# EAGLE design LED (EAGLE 9.2.2)
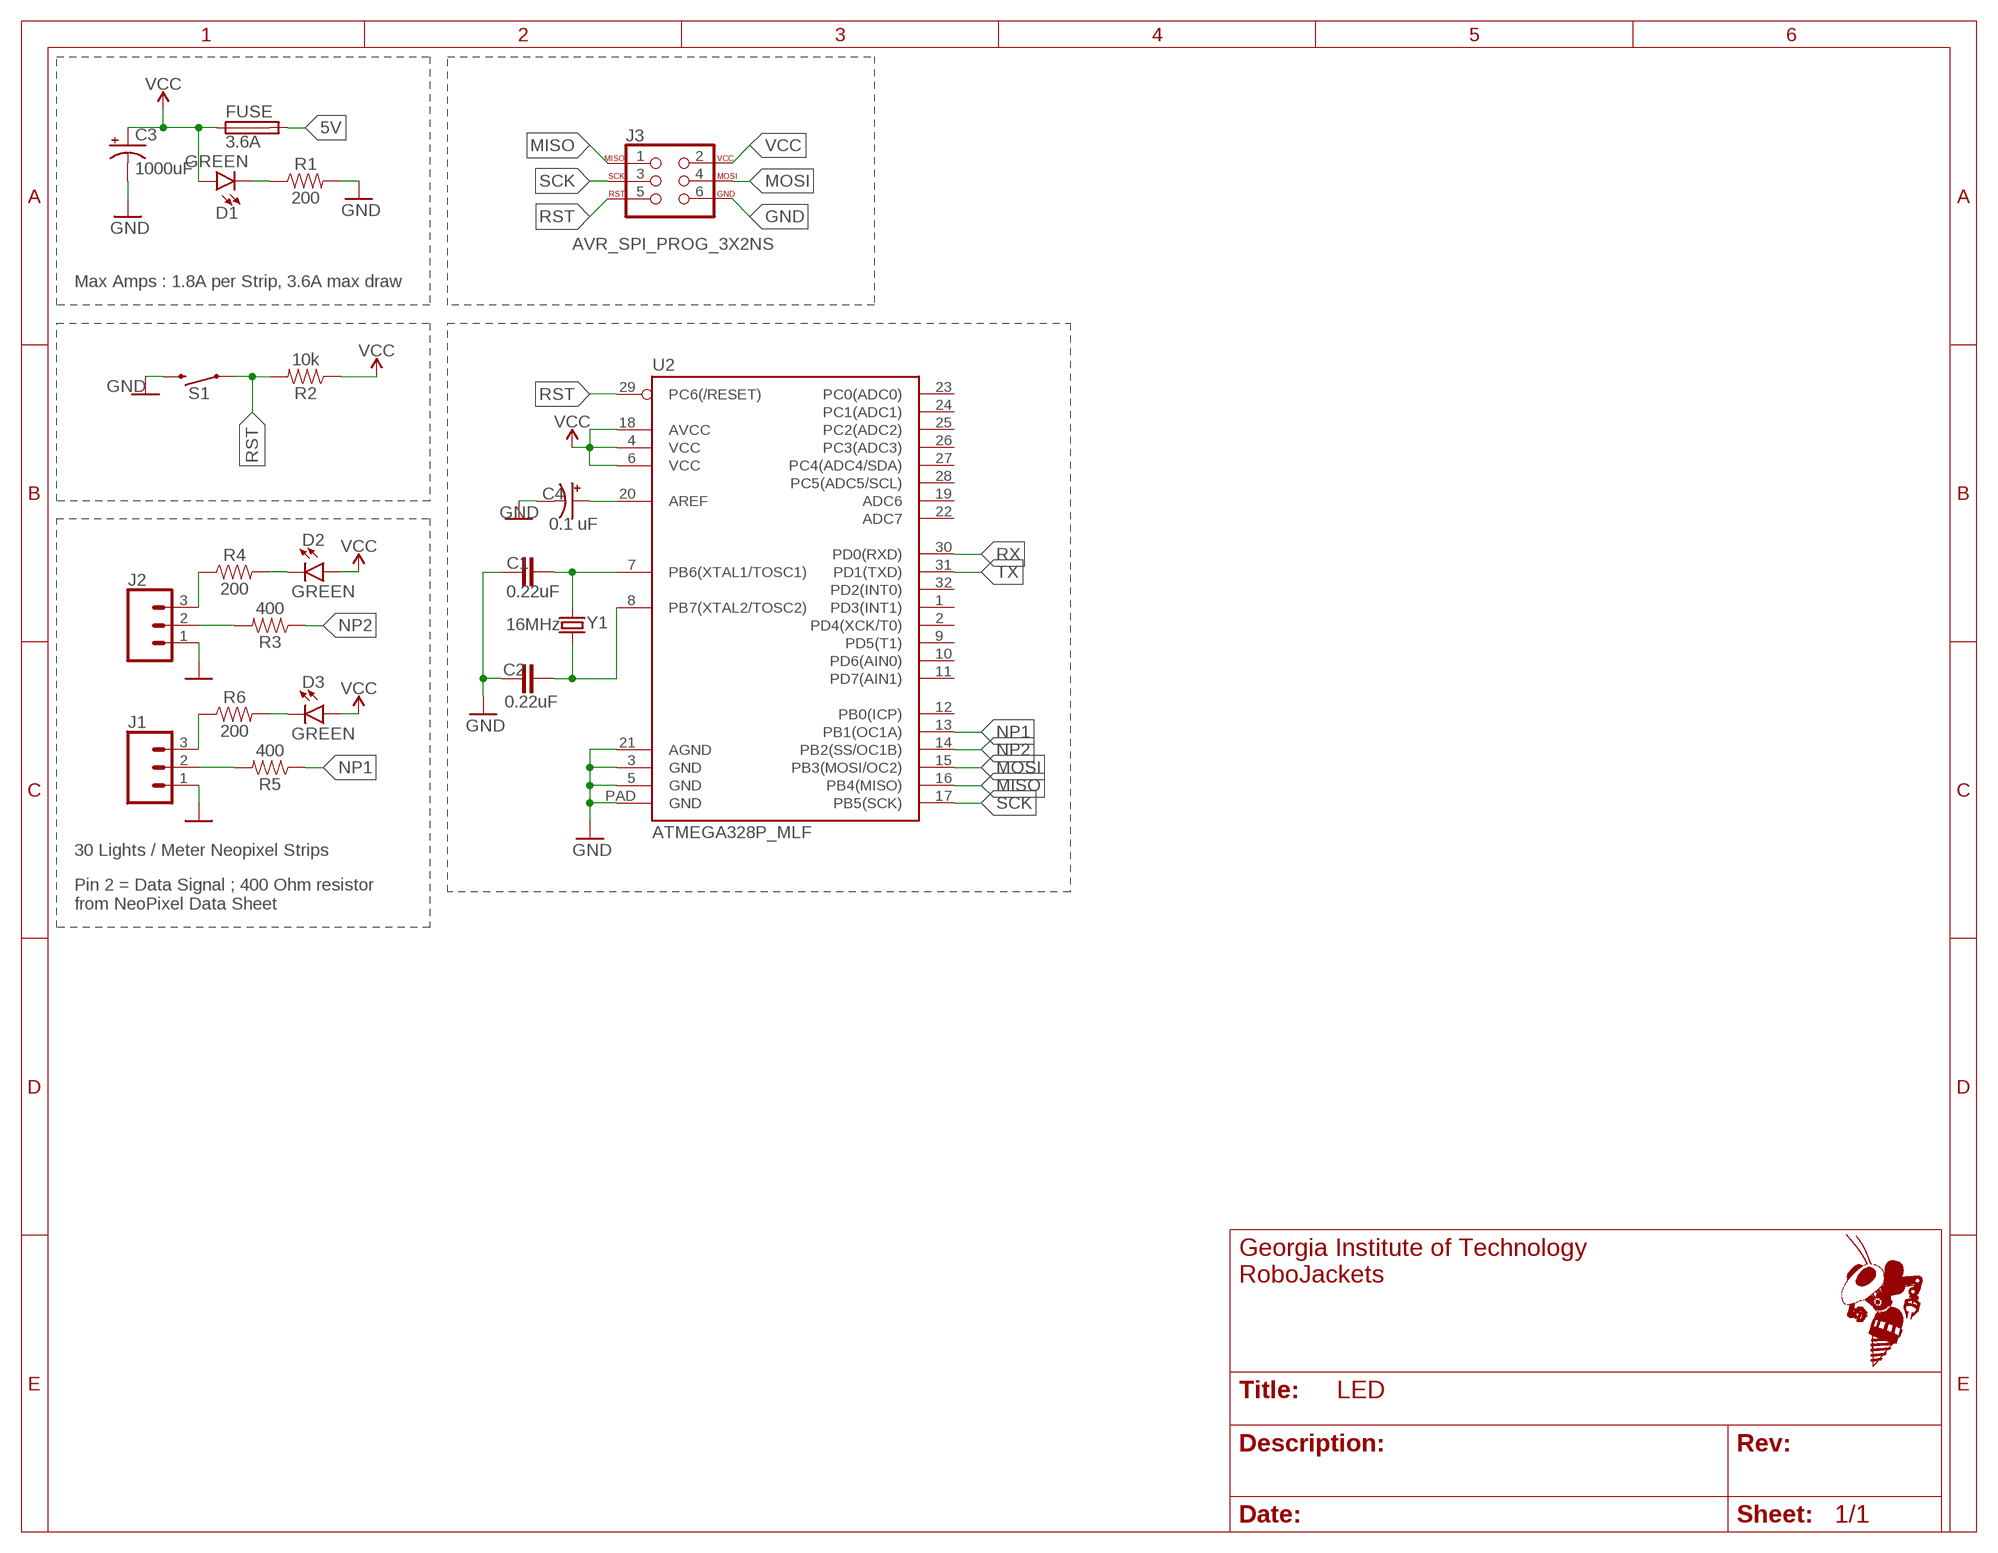
[diagram p0: schematic, sheet 1]

## Parts
C1  0.22uF  0.22UF-0603-25V-10%  [0603]
C2  0.22uF  0.22UF-0603-25V-10%  [0603]
C3  1000uF  1000UF-RADIAL-5MM-25V-20%  [CPOL-RADIAL-5MM-10MM]
C4  0.1 uF  1000UF-RADIAL-5MM-25V-20%  [CPOL-RADIAL-5MM-10MM]
D1  GREEN  LED-GREEN0603  [LED-0603]
D2  GREEN  LED-GREEN0603  [LED-0603]
D3  GREEN  LED-GREEN0603  [LED-0603]
FUSE  3.6A  FUSE_HOLDER  [FUSE_HOLDER]
J1  CONN_03  [1X03]
J2  CONN_03  [1X03]
J3  AVR_SPI_PROG_3X2NS  [2X3-NS]
R1  200  470OHM-0603-1/10W-1%  [0603]
R2  10k  470OHM-0603-1/10W-1%  [0603]
R3  400  470OHM-0603-1/10W-1%  [0603]
R4  200  470OHM-0603-1/10W-1%  [0603]
R5  400  470OHM-0603-1/10W-1%  [0603]
R6  200  470OHM-0603-1/10W-1%  [0603]
S1  MOMENTARY-SWITCH-SPST-PTH-6.0MM-KIT  [TACTILE_SWITCH_PTH_6.0MM_KIT]
U2  ATMEGA328P_MLF  ATMEGA328P_MLFMLF32  [MLF32-PAD]
Y1  16MHz  CRYSTAL-16MHZPTH-HC49US  [HC49US]

## Nets
5V: FUSE.P$3 FUSE.P$4
DATA1: J1.2 R5.2
DATA2: J2.2 R3.2
GND: C1.2 C2.2 C3.- C4.- J1.1 J2.1 J3.6 R1.2 S1.3 U2.3(GND) U2.5(GND) U2.21(AGND) U2.PAD(GND)
MISO: J3.1 U2.16(PB4(MISO))
MOSI: J3.4 U2.15(PB3(MOSI/OC2))
N$1: C4.+ U2.20(AREF)
N$2: D2.C R4.2
N$3: J2.3 R4.1
N$4: D3.C R6.2
N$5: J1.3 R6.1
N$10: D1.C R1.1
NP1: R5.1 U2.13(PB1(OC1A))
NP2: R3.1 U2.14(PB2(SS/OC1B))
RST: J3.5 R2.2 S1.1 U2.29(PC6(/RESET))
RX: U2.30(PD0(RXD))
SCK: J3.3 U2.17(PB5(SCK))
TX: U2.31(PD1(TXD))
VCC: C3.+ D1.A D2.A D3.A FUSE.P$1 FUSE.P$2 J3.2 R2.1 U2.4(VCC) U2.6(VCC) U2.18(AVCC)
XTAL1: C1.1 U2.7(PB6(XTAL1/TOSC1)) Y1.1
XTAL2: C2.1 U2.8(PB7(XTAL2/TOSC2)) Y1.2
Unconnected: U2.1(PD3(INT1)) U2.2(PD4(XCK/T0)) U2.9(PD5(T1)) U2.10(PD6(AIN0)) U2.11(PD7(AIN1)) U2.12(PB0(ICP)) U2.19(ADC6) U2.22(ADC7) U2.23(PC0(ADC0)) U2.24(PC1(ADC1)) U2.25(PC2(ADC2)) U2.26(PC3(ADC3)) U2.27(PC4(ADC4/SDA)) U2.28(PC5(ADC5/SCL)) U2.32(PD2(INT0))

## Notes on the sheet
- Max Amps : 1.8A per Strip, 3.6A max draw
- 30 Lights / Meter Neopixel Strips
- Pin 2 = Data Signal ; 400 Ohm resistor 
  from NeoPixel Data Sheet

## Library data of the parts
C1 C2 = SparkFun-Capacitors:0.22UF: 0.22µF ceramic capacitors A capacitor is a passive two-terminal electrical component used to store electrical energy temporarily in an electric field.; PROD_ID: CAP-07822
C3 C4 = SparkFun-Capacitors:1000UF: 1,000µF/1mF ceramic capacitors A capacitor is a passive two-terminal electrical component used to store electrical energy temporarily in an electric field. CAP-08070; PROD_ID: CAP-09538; VALUE: 1mF
D1-D3 = SparkFun-LED:LED-GREEN: Green SMD LED Used in manufacturing of various products at SparkFun Packages: 0603 - SMD 0603 package [Product Link] <http://www.futureelectronics.com/en/technologies/semiconductors/optoelectronics/leds/Pages/9894312-LTST-C190GKT.aspx?CrossPart=HSMG-C190&IM=0> LilyPad 1206 - SMD1206 LilyPad package [Product Link] <http://www.futureelectronics.com/en/Technologies/Product.aspx?ProductID=IN150NGHARVATEKCORPORATION2049943&IM=0> 1206 - SMD1206 package [Product Link] <http://www.futureelectronics.com/en/technologies/semiconductors/optoelectronics/leds/Pages/8315665-LTST-C150KGKT.aspx?IM=0> 1206 Bottom Mount -SMD 1206 Bottom Mount [Product Link] <http://www.digikey.com/product-detail/en/lite-on-inc/LTST-C230KGKT/160-1456-1-ND/386854> SparkFun Products: Pro Mini 328 -5V <https://www.sparkfun.com/products/821> RedBoard <https://www.sparkfun.com/products/12757> MP3 Trigger <https://www.sparkfun.com/products/13720> Makey Makey <https://www.sparkfun.com/products/11076>; PROD_ID: DIO-00821
FUSE = IGVC-Misc:FUSE_HOLDER
J1 J2 = SparkFun-Connectors:CONN_03: Multi connection point. Often used as Generic Header-pin footprint for 0.1 inch spaced/style header connections On any of the 0.1 inch spaced packages, you can populate with these: Break Away Headers - Straight <https://www.sparkfun.com/products/116> (PRT-00116) Break Away Male Headers - Right Angle <https://www.sparkfun.com/products/553> (PRT-00553) Female Headers <https://www.sparkfun.com/products/115> (PRT-00115) Break Away Headers - Machine Pin <https://www.sparkfun.com/products/117> (PRT-00117) Break Away Female Headers - Swiss Machine Pin <https://www.sparkfun.com/products/743> (PRT-00743) Stackable Header - 3 Pin (Female, 0.1") <https://www.sparkfun.com/products/13875> (PRT-13875) For SCREWTERMINALS and SPRING TERMINALS visit here: Screw Terimnals on SparkFun.com <https://www.sparkfun.com/search/results?term=Screw+Terminals> (5mm/3.5mm/2.54mm spacing) This device is also useful as a general connection point to wire up your design to another part of your project. Our various solder wires solder well into these plated through hole pads. Hook-Up Wire - Assortment (Stranded, 22 AWG) <https://www.sparkfun.com/products/11375> (PRT-11375) Hook-Up Wire - Assortment (Solid Core, 22 AWG) <https://www.sparkfun.com/products/11367> (PRT-11367) View the entire wire category on our website here <https://www.sparkfun.com/categories/141> Special notes: Molex polarized connector foot print use with SKU : PRT-08232 with associated crimp pins and housings.; SPICEPREFIX: J
J3 = SparkFun-Connectors:AVR_SPI_PROG_3X2: AVR ISP 6 Pin This is the reduced ISP connector for AVR programming. Common on Arduino. This footprint will take up less PCB space and can be used with a 10-pin to 6-pin adapter such as SKU: BOB-08508 **Special note about "TEST_POINT" package. The stop mask is on the top side, so if you want your programming test points to be on the bottom of your board, make sure to place this package on the bottom side of the board. This also ensure that the orientation to program from the bottom side will be correct. SparkFun Products: SparkFun ISP Pogo Adapter <https://www.sparkfun.com/products/11591> - NS Tiny AVR Programmer <https://www.sparkfun.com/products/11801> -PTH
R1-R6 = SparkFun-Resistors:470OHM: 470Ω resistor A resistor is a passive two-terminal electrical component that implements electrical resistance as a circuit element. Resistors act to reduce current flow, and, at the same time, act to lower voltage levels within circuits. - Wikipedia; PROD_ID: RES-07869; VALUE: 470
S1 = SparkFun-Switches:MOMENTARY-SWITCH-SPST: Momentary Switch (Pushbutton) - SPST Normally-open (NO) SPST momentary switches (buttons, pushbuttons). Variants PTH-12MM - 12mm square, through-hole Momentary Pushbutton Switch - 12mm Square <https://www.sparkfun.com/products/9190> (COM-09190) PTH-6.0MM, PTH-6.0MM-KIT - 6.0mm square, through-hole Mini Pushbutton Switch <https://www.sparkfun.com/products/97> (COM-00097) KIT package intended for soldering kit's - only one side of pads' copper is exposed. PTH-RIGHT-ANGLE-KIT - Right-angle, through-hole Right Angle Tactile Button <https://www.sparkfun.com/products/10791> - Used on SparkFun BigTime Watch Kit <https://www.sparkfun.com/products/11734> SMD-12MM - 12mm square, surface-mount Tactile Button - SMD (12mm) <https://www.sparkfun.com/products/12993> (COM-12993) Used on SparkFun PicoBoard <https://www.sparkfun.com/products/11888> SMD-4.5MM - 4.5mm Square Trackball Switch Used on SparkFun Blackberry Trackballer Breakout <https://www.sparkfun.com/products/13169> SMD-4.6MMX2.8MM - 4.60mm x 2.80mm, surface mount Used on SparkFun SAMD21 Mini Breakout <https://www.sparkfun.com/products/13664> SMD-5.2MM, SMD-5.2-REDUNDANT - 5.2mm square, surface-mount Mini Pushbutton Switch - SMD <https://www.sparkfun.com/products/8720> (COM-08720) Used on Arduino Pro Mini <https://www.sparkfun.com/products/11114> REDUNDANT package connects both switch circuits together SMD-6.0X3.5MM - 6.0 x 3.5mm, surface mount Momentary Reset Switch SMD <https://www.sparkfun.com/products/8229> (COM-08229) SMD-6.2MM-TALL - 6.2mm square, surface mount Tactile Button - SMD (6mm) <https://www.sparkfun.com/products/12992> Used on SparkFun Digital Sandbox <https://www.sparkfun.com/products/12651> SMD-RIGHT-ANGLE - Right-angle, surface mount Used on SparkFun Block for Intel® Edison - Arduino <https://www.sparkfun.com/products/13036>; PROD_ID: SWCH-08441; SF_SKU: COM-00097
U2 = SparkFun-IC-Microcontroller:ATMEGA328P_MLF: Datasheet SparkFun Products () () 32-Pin Atmega328 part Commonly used on Arduino compatible boards Available in QFP and QFN packages TQFP is IC-09069 QFN is non-stock
Y1 = SparkFun-Clocks:CRYSTAL-16MHZ: 16MHz Crystal Digikey Example <http://www.digikey.com/product-search/en?keywords=535-9122-1-ND> Frequency: 16MHz Frequency Stability: ±50ppm Frequency Tolerance: ±20ppm Load Capacitance: 18pF SparkFun Products: Pro Micro -5V/16MHz <https://www.sparkfun.com/products/12640> SparkFun Serial Enabled LCD Kit <https://www.sparkfun.com/products/10097>; PROD_ID: XTAL-08181; SF_ID: COM-00536

## Board
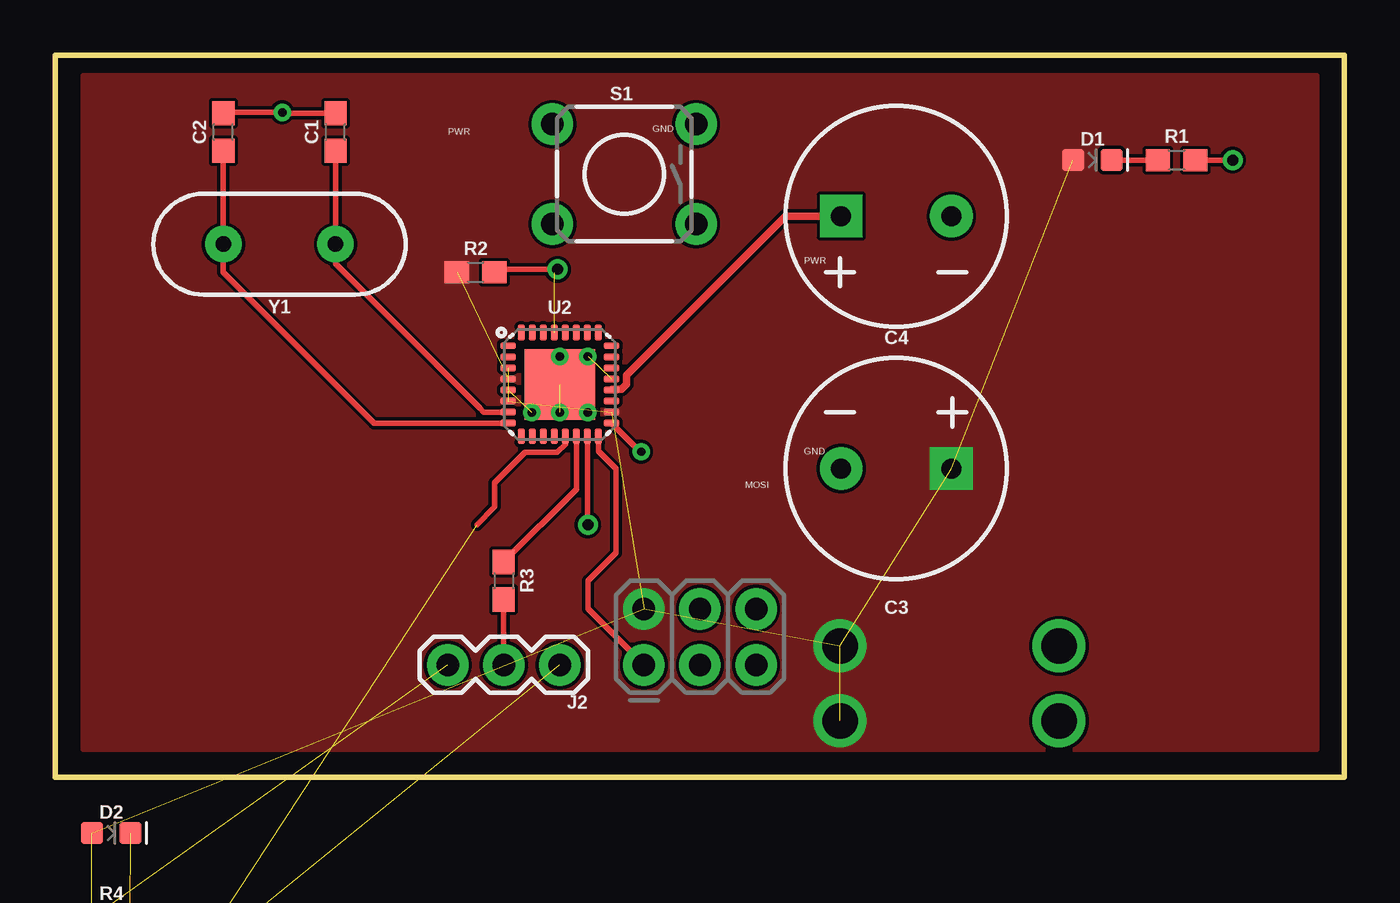
[diagram p1: board, top side]
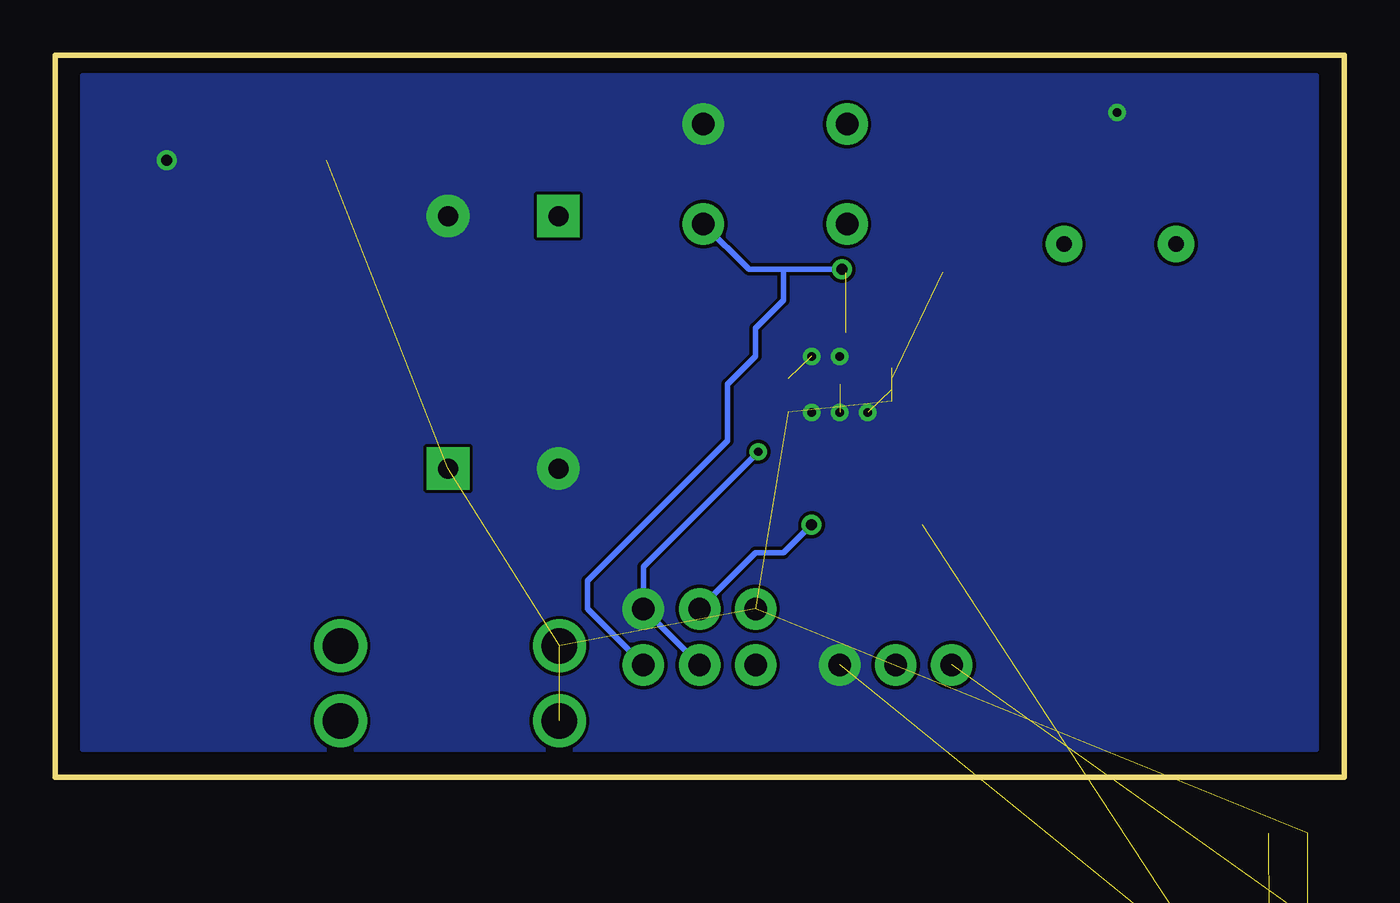
[diagram p2: board, bottom side, seen from below]

Size 58.4 x 32.69 mm. Coordinates in mm from the lower left corner, seen from the top.
Outline: 0,0 58.4,0 58.4,32.69 0,32.69 0,0
Copper layers (1*16): Top 0.0356mm / dielectric 63mil / Bottom 0.0356mm
Design rules "RJ2LayerDRU": minimum track width 6mil, minimum drill 15mil, track to track 6mil, track to pad 6mil, pad to pad 6mil, via to via 6mil, smd to smd 6mil, copper to edge 0mil, drill to drill 6mil, minimum pad ring 10mil, minimum via ring 8mil, stop-mask expansion 4mil, vias tented up to drill 0mil, thermal gap 10mil

### Footprints (pad centres in the part's own frame; a part is rotated, then mirrored left to right if it is on the bottom)
0603 = smd 1.1 x 1: 1 -0.85,0; 2 0.85,0
CPOL-RADIAL-5MM-10MM = drill 0.9 pad 1.93 square: + 2.5,0 | drill 0.9 pad 1.93: - -2.5,0
LED-0603 = smd 1 x 1: A -0.877,0; C 0.877,0
FUSE_HOLDER = drill 1.6: P$1 0,0; P$2 0,3.4; P$3 9.92,3.4; P$4 9.92,0
1X03 = drill 1.016 pad 1.88: 1 0,0; 2 2.54,0; 3 5.08,0
2X3-NS = drill 1.016 pad 1.88: 1 -2.54,-1.27; 2 -2.54,1.27; 3 0,-1.27; 4 0,1.27; 5 2.54,-1.27; 6 2.54,1.27
TACTILE_SWITCH_PTH_6.0MM_KIT = drill 1.016 pad 1.88: 1 -3.251,2.261; 2 3.251,2.261; 3 -3.251,-2.261; 4 3.251,-2.261
MLF32-PAD = smd 0.7 x 0.3: 1 -2.35,1.75; 2 -2.35,1.25; 3 -2.35,0.75; 4 -2.35,0.25; 5 -2.35,-0.25; 6 -2.35,-0.75; 7 -2.35,-1.25; 8 -2.35,-1.75; 17 2.35,-1.75; 18 2.35,-1.25; 19 2.35,-0.75; 20 2.35,-0.25; 21 2.35,0.25; 22 2.35,0.75; 23 2.35,1.25; 24 2.35,1.75 | smd 0.3 x 0.7: 9 -1.75,-2.35; 10 -1.25,-2.35; 11 -0.75,-2.35; 12 -0.25,-2.35; 13 0.25,-2.35; 14 0.75,-2.35; 15 1.25,-2.35; 16 1.75,-2.35; 25 1.75,2.35; 26 1.25,2.35; 27 0.75,2.35; 28 0.25,2.35; 29 -0.25,2.35; 30 -0.75,2.35; 31 -1.25,2.35; 32 -1.75,2.35 | smd 3.2 x 3.2: PAD 0,0
HC49US = drill 0.7 pad 1.651: 1 -2.54,0; 2 2.54,0

### Placement (x,y rotation side)
C1  12.7,29.21 90 top
C2  7.62,29.21 90 top
C3  38.1,13.97 0 top
C4  38.1,25.4 180 top
D1  46.99,27.94 0 top
D2  2.54,-2.54 0 top
D3  2.54,-19.05 0 top  (outside the outline)
FUSE  35.56,2.54 0 top
J1  2.54,-11.43 0 top  (outside the outline)
J2  22.86,5.08 180 top
J3  29.21,6.35 0 top
R1  50.8,27.94 0 top
R2  19.05,22.86 0 top
R3  20.32,8.89 270 top
R4  2.54,-6.35 0 top  (outside the outline)
R5  2.54,-15.24 0 top  (outside the outline)
R6  6.35,-15.24 0 top  (outside the outline)
S1  25.78,27.3 180 top
U2  22.86,17.78 0 top
Y1  10.16,24.13 180 top

### Tracks (layer width: path | path; a pad name or v marks a point on that pad's centre or on a via)
DATA1  (1 unrouted)
DATA2
  Top 0.254: R3.2 J2.2
GND  (via drill 0.38, 0.5)  (5 unrouted)
  Top 0.254: v53.34,27.94 R1.2 | C1.2 10.33,30.06 v10.29,30.1 7.66,30.1 C2.2
  other vias: 21.59,16.51 22.86,16.51 22.86,19.05 24.13,19.05 24.13,16.51
  pour Bottom (no thermals): 1.27,31.75 57.15,31.75 57.15,1.27 1.27,1.27
MISO
  Top 0.254: J3.1 24.13,7.62 24.13,8.89 25.4,10.16 25.4,13.97 24.61,14.76 U2.16
MOSI  (via drill 0.5)
  Top 0.254: v24.13,11.43 24.11,11.45 U2.15
  Bottom 0.254: J3.4 26.67,10.16 25.4,10.16 v24.13,11.43
N$1
  Top 0.35: C4.+ 33.08,25.4 25.89,18.21 25.89,17.79 25.65,17.55 25.23,17.55 U2.20
N$2  (1 unrouted)
N$3  (1 unrouted)
N$4  (1 unrouted)
N$5  (1 unrouted)
N$10
  Top 0.254: D1.C R1.1
NP1  (1 unrouted)
  Top 0.254: 19.11,11.43 19.91,12.23 19.91,13.33 21.29,14.7 22.73,14.7 23.11,15.08 U2.13
NP2
  Top 0.254: U2.14 23.61,13.03 R3.1
RST  (via drill 0.5)  (1 unrouted)
  Top 0.254: R2.2 20.03,22.99 v22.76,22.99 arc90 22.61,22.84
  Bottom 0.254: 25.4,22.99 25.4,21.59 26.67,20.32 26.67,19.05 27.94,17.78 27.94,15.24 34.29,8.89 34.29,7.62 J3.5 | 25.4,22.99 v22.76,22.99 | 25.4,22.99 26.97,22.99 S1.1
SCK  (via drill 0.38)
  Top 0.254: U2.17 26.54,14.7 v26.54,14.73
  Bottom 0.254: v26.54,14.73 31.75,9.53 31.75,7.62 J3.3
VCC  (10 unrouted)
  pour Top (no thermals): 1.27,31.75 57.15,31.75 57.15,1.27 1.27,1.27
XTAL1
  Top 0.254: C1.1 Y1.1 12.7,23.24 19.24,16.7 19.41,16.53 U2.7
XTAL2
  Top 0.254: U2.8 14.45,16.03 7.62,22.86 Y1.2 C2.1

### Text on the board
tNames: PWR | GND | PWR | GND | MOSI